# EAGLE design board_revA (EAGLE 7.4.0)
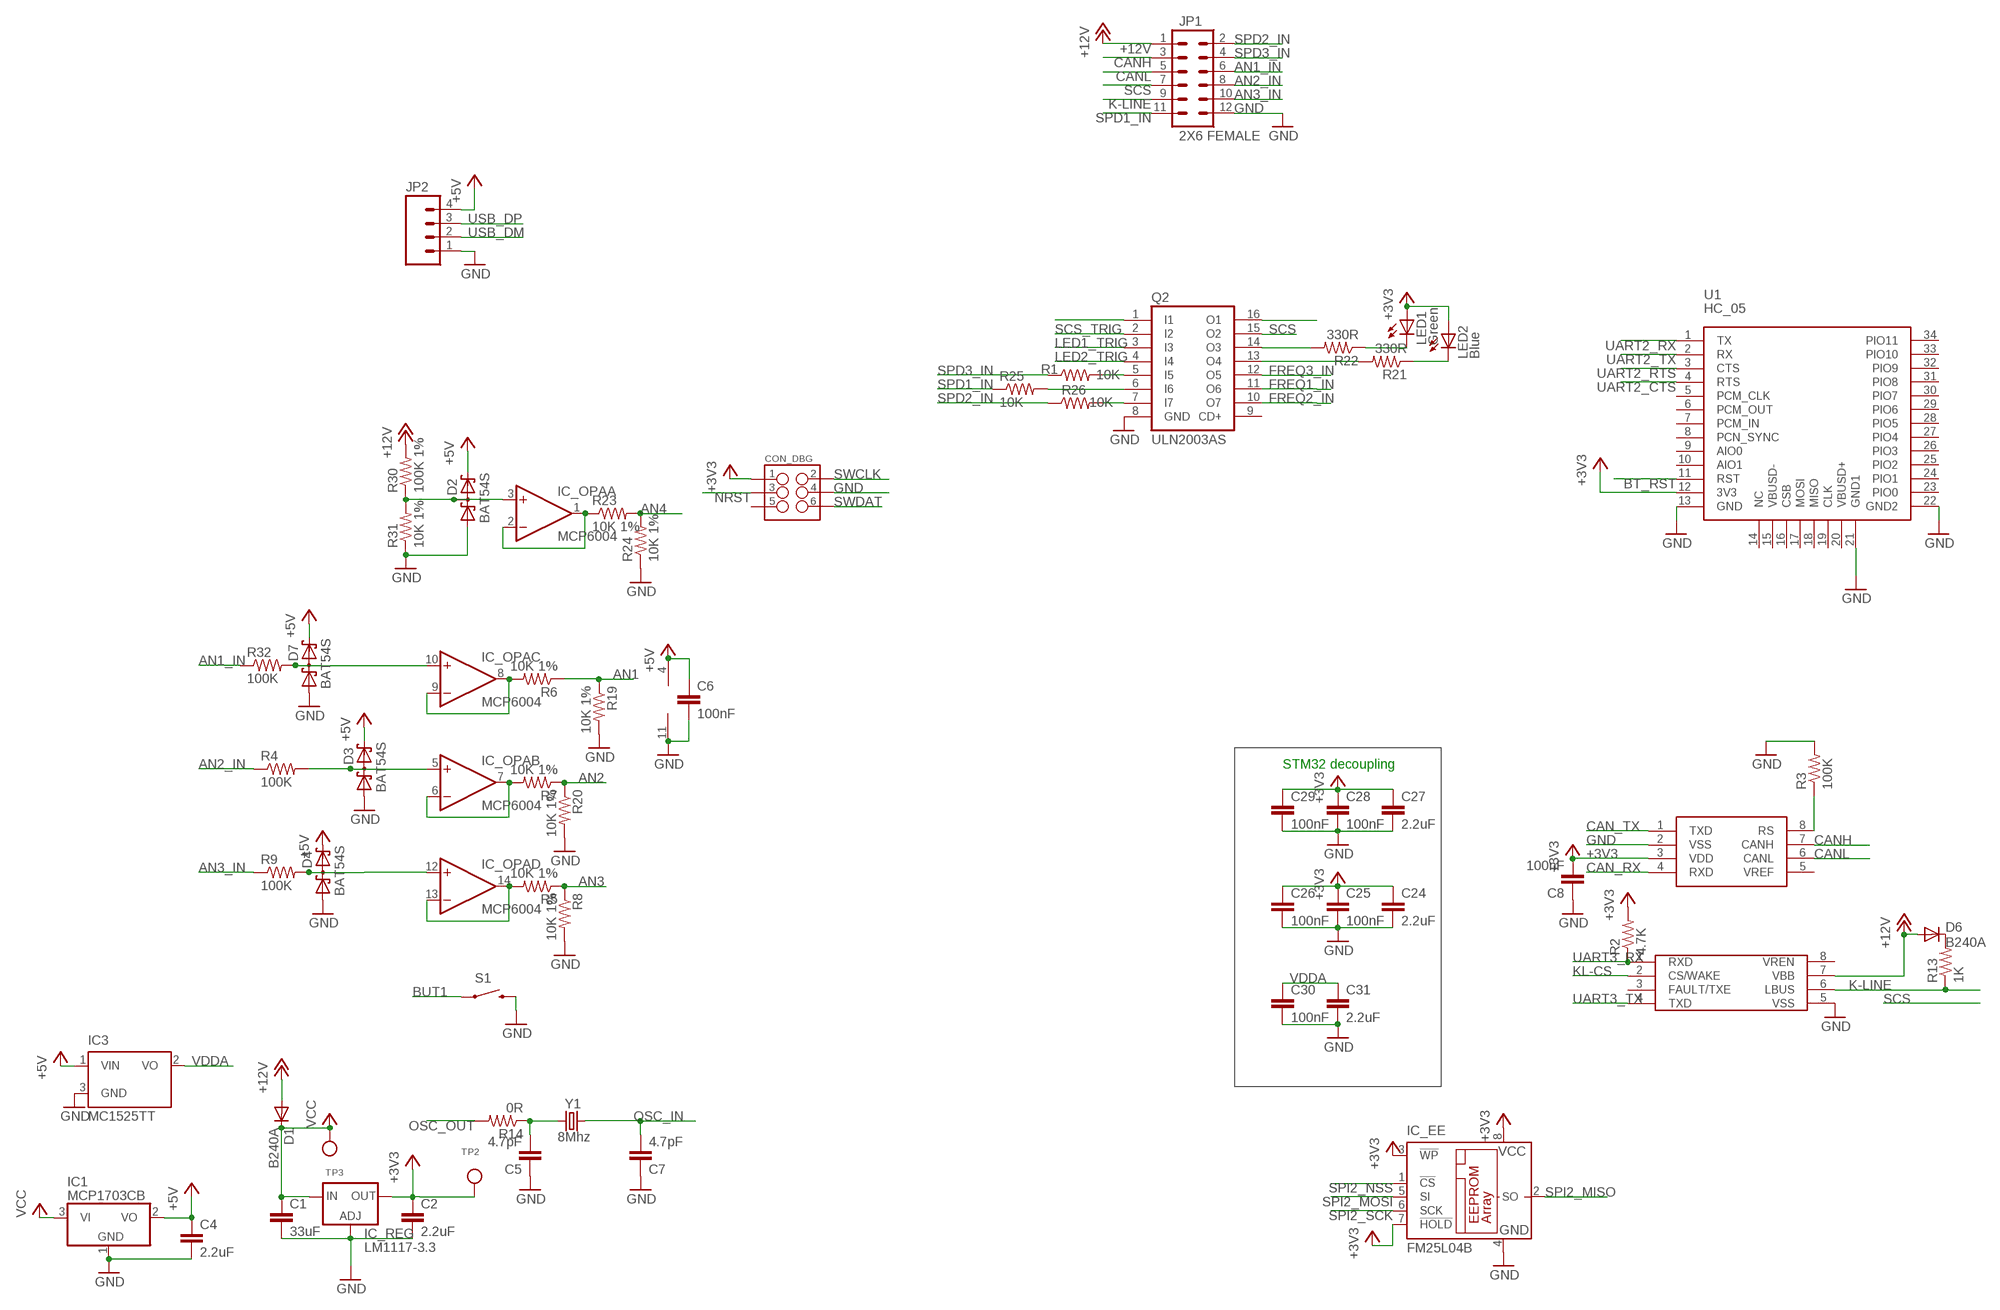
[diagram p0: schematic, sheet 1, part 1 of 2]
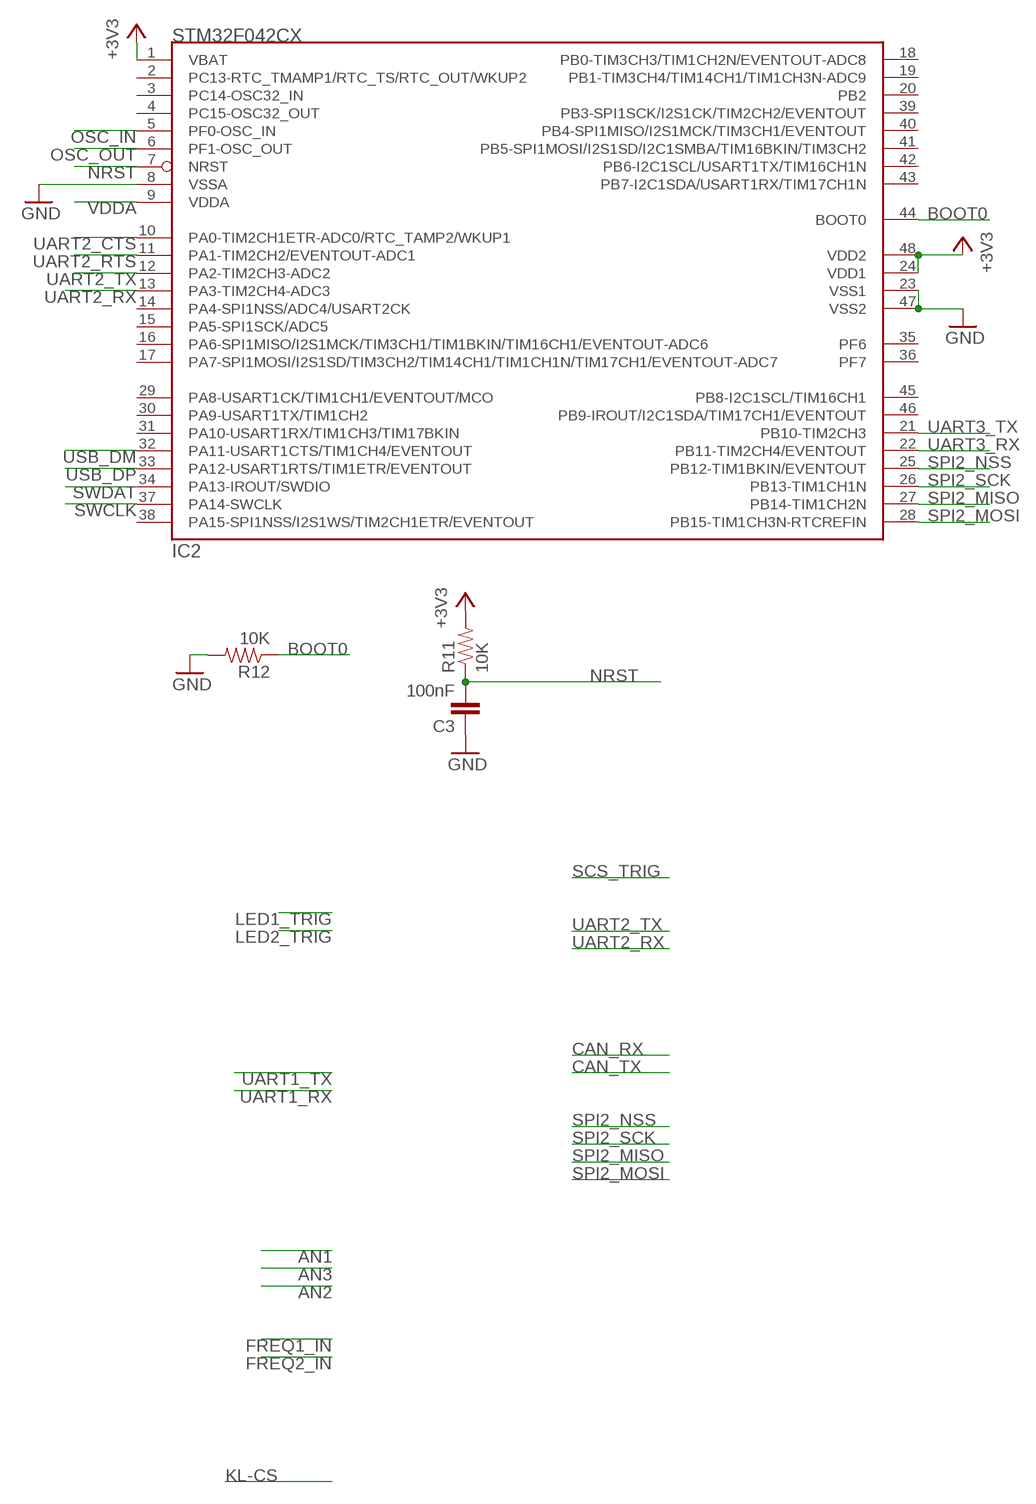
[diagram p1: schematic, sheet 1, part 2 of 2]

## Parts
C1  33uF  CAPPTH  [CAP-PTH-SMALL]
C2  2.2uF  CAP0603-CAP  [0603-CAP]
C3  100nF  CAP0603-CAP  [0603-CAP]
C4  2.2uF  CAP0603-CAP  [0603-CAP]
C5  4.7pF  CAP0603-CAP  [0603-CAP]
C6  100nF  CAP0603-CAP  [0603-CAP]
C7  4.7pF  CAP0603-CAP  [0603-CAP]
C8  100nF  CAP0603-CAP  [0603-CAP]
C24  2.2uF  CAP0603-CAP  [0603-CAP]
C25  100nF  CAP0603-CAP  [0603-CAP]
C26  100nF  CAP0603-CAP  [0603-CAP]
C27  2.2uF  CAP0603-CAP  [0603-CAP]
C28  100nF  CAP0603-CAP  [0603-CAP]
C29  100nF  CAP0603-CAP  [0603-CAP]
C30  100nF  CAP0603-CAP  [0603-CAP]
C31  2.2uF  CAP0603-CAP  [0603-CAP]
CON_DBG  M03X22X3_SILK_SM  [2X3]
D1  B240A  DIODESOD  [SOD-323]
D2  BAT54S  [SOT23]
D3  BAT54S  [SOT23]
D4  BAT54S  [SOT23]
D6  B240A  DIODESOD  [SOD-323]
D7  BAT54S  [SOT23]
IC1  MCP1703CB  [SOT23]
IC2  STM32F042CX  STM32F050CX  [LQFP48]
IC3  MC1525TT  [SOT23]
IC_CAN  MAX3051  MCP2551  [SO08]
IC_EE  FM25L04B  25LC080SN  [SO-08]
IC_KLINE  MCP2004  [SO08]
IC_OPA  MCP6004  LMV324MZ  [TSSOP14]
IC_REG  LM1117-3.3  LD117AS33TR  [SOT223]
JP1  2X6 FEMALE  M06X2PTH_FEMALE  [2X6]
JP2  M04LOCK  [1X04_LOCK]
LED1  Green  LED3MM  [LED3MM]
LED2  Blue  LED3MM  [LED3MM]
Q2  ULN2003AS  [SSOP16]
R1  10K  RESISTOR0603-RES  [0603-RES]
R2  4.7K  RESISTOR0603-RES  [0603-RES]
R3  100K  RESISTOR0603-RES  [0603-RES]
R4  100K  RESISTOR0603-RES  [0603-RES]
R5  10K 1%  RESISTOR0603-RES  [0603-RES]
R6  10K 1%  RESISTOR0603-RES  [0603-RES]
R7  10K 1%  RESISTOR0603-RES  [0603-RES]
R8  10K 1%  RESISTOR0603-RES  [0603-RES]
R9  100K  RESISTOR0603-RES  [0603-RES]
R11  10K  RESISTOR0603-RES  [0603-RES]
R12  10K  RESISTOR0603-RES  [0603-RES]
R13  1K  RESISTOR0603-RES  [0603-RES]
R14  0R  RESISTOR0603-RES  [0603-RES]
R19  10K 1%  RESISTOR0603-RES  [0603-RES]
R20  10K 1%  RESISTOR0603-RES  [0603-RES]
R21  330R  RESISTOR0603-RES  [0603-RES]
R22  330R  RESISTOR0603-RES  [0603-RES]
R23  10K 1%  RESISTOR0603-RES  [0603-RES]
R24  10K 1%  RESISTOR0603-RES  [0603-RES]
R25  10K  RESISTOR0603-RES  [0603-RES]
R26  10K  RESISTOR0603-RES  [0603-RES]
R30  100K 1%  RESISTOR0603-RES  [0603-RES]
R31  10K 1%  RESISTOR0603-RES  [0603-RES]
R32  100K  RESISTOR0603-RES  [0603-RES]
S1  SWITCH-MOMENTARY-2PTH  [TACTILE-PTH]
TP2  TESTPOINTROUND1MM  [TESTPOINT_ROUND_1MM]
TP3  TESTPOINTROUND1MM  [TESTPOINT_ROUND_1MM]
U1  HC_05  [BLUETOOTH_SMD]
Y1  8Mhz  CRYSTALHC49US  [HC49US]

## Nets
+3V3: C2.1 C8.2 C24.1 C25.1 C26.1 C27.1 C28.1 C29.1 CON_DBG.1 IC2.1(VBAT) IC_CAN.3(VDD) IC_EE.3(!WP) IC_EE.7(!HOLD) IC_EE.8(VCC) IC_REG.4(OUT) LED1.A LED2.A R2.2 R11.2 TP2.P$1 U1.12(3V3)
+5V: C4.1 C6.1 D2.2(C2) D3.2(C2) D4.2(C2) D7.2(C2) IC1.2(VO) IC3.1(VIN) IC_OPA.4(P:V+) JP2.4
+12V: D1.2(A) D6.2(A) IC_KLINE.7(VBB) JP1.1 R30.2
AN1: R6.1 R19.1
AN1_IN: JP1.6 R32.1
AN1_N: IC_OPA.1(A:OUT) IC_OPA.2(A:-IN) R23.1
AN2: R7.1 R20.1
AN2_IN: JP1.8 R4.1
AN2_N: IC_OPA.8(C:OUT) IC_OPA.9(C:-IN) R6.2
AN3: R5.1 R8.1
AN3_IN: JP1.10 R9.1
AN3_N: IC_OPA.6(B:-IN) IC_OPA.7(B:OUT) R7.2
AN4: R23.2 R24.2
BOOT0: IC2.44(BOOT0) R12.1
BT_RST: U1.11(RST)
BUT1: S1.1
CAN_RX: IC_CAN.4(RXD)
CAN_TX: IC_CAN.1(TXD)
CANH: IC_CAN.7(CANH) JP1.3
CANL: IC_CAN.6(CANL) JP1.5
FREQ1_IN: Q2.11(O6)
FREQ2_IN: Q2.10(O7)
FREQ3_IN: Q2.12(O5)
GND: C1.2 C2.2 C3.1 C4.2 C5.1 C6.2 C7.1 C8.1 C24.2 C25.2 C26.2 C27.2 C28.2 C29.2 C30.2 C31.2 CON_DBG.4 D2.1(A1) D3.1(A1) D4.1(A1) D7.1(A1) IC1.1(GND) IC2.8(VSSA) IC2.23(VSS1) IC2.47(VSS2) IC3.3(GND) IC_CAN.2(VSS) IC_EE.4(GND) IC_KLINE.5(VSS) IC_OPA.11(P:V-) IC_REG.1(ADJ) JP1.12 JP2.1 Q2.8(GND) R3.2 R8.2 R12.2 R19.2 R20.2 R24.1 R31.1 S1.3 U1.13(GND) U1.21(GND1) U1.22(GND2)
K-LINE: IC_KLINE.6(LBUS) JP1.9 R13.1
KL-CS: IC_KLINE.2(CS/WAKE)
LED1_TRIG: Q2.3(I3)
LED2_TRIG: Q2.4(I4)
N$1: Q2.5(I5) R1.2
N$2: IC_OPA.13(D:-IN) IC_OPA.14(D:OUT) R5.2
N$3: D4.3(C1A2) IC_OPA.12(D:+IN) R9.2
N$4: Q2.1(I1)
N$5: D3.3(C1A2) IC_OPA.5(B:+IN) R4.2
N$6: Q2.16(O1)
N$8: IC_CAN.8(RS) R3.1
N$9: Q2.7(I7) R26.2
N$10: LED2.K(C) R21.1
N$11: Q2.13(O4) R21.2
N$13: D6.1(C) R13.2
N$14: C5.2 R14.1 Y1.1
N$15: Q2.14(O3) R22.2
N$16: Q2.6(I6) R25.2
N$19: LED1.K(C) R22.1
N$24: D2.3(C1A2) IC_OPA.3(A:+IN) R30.1 R31.2
N$25: D7.3(C1A2) IC_OPA.10(C:+IN) R32.2
NRST: C3.2 CON_DBG.3 IC2.7(NRST) R11.1
OSC_IN: C7.2 IC2.5(PF0-OSC_IN) Y1.2
OSC_OUT: IC2.6(PF1-OSC_OUT) R14.2
SCS: JP1.7 Q2.15(O2)
SCS_TRIG: Q2.2(I2)
SPD1_IN: JP1.11 R25.1
SPD2_IN: JP1.2 R26.1
SPD3_IN: JP1.4 R1.1
SPI2_MISO: IC2.27(PB14-TIM1CH2N) IC_EE.2(SO)
SPI2_MOSI: IC2.28(PB15-TIM1CH3N-RTCREFIN) IC_EE.5(SI)
SPI2_NSS: IC2.25(PB12-TIM1BKIN/EVENTOUT) IC_EE.1(!CS)
SPI2_SCK: IC2.26(PB13-TIM1CH1N) IC_EE.6(SCK)
SWCLK: CON_DBG.2 IC2.37(PA14-SWCLK)
SWDAT: CON_DBG.6 IC2.34(PA13-IROUT/SWDIO)
UART2_CTS: IC2.10(PA0-TIM2CH1ETR-ADC0/RTC_TAMP2/WKUP1) U1.4(RTS)
UART2_RTS: IC2.11(PA1-TIM2CH2/EVENTOUT-ADC1) U1.3(CTS)
UART2_RX: IC2.13(PA3-TIM2CH4-ADC3) U1.1(TX)
UART2_TX: IC2.12(PA2-TIM2CH3-ADC2) U1.2(RX)
UART3_RX: IC2.22(PB11-TIM2CH4/EVENTOUT) IC_KLINE.1(RXD) R2.1
UART3_TX: IC2.21(PB10-TIM2CH3) IC_KLINE.4(TXD)
USB_DM: IC2.32(PA11-USART1CTS/TIM1CH4/EVENTOUT) JP2.2
USB_DP: IC2.33(PA12-USART1RTS/TIM1ETR/EVENTOUT) JP2.3
VCC: C1.1 D1.1(C) IC1.3(VI) IC_REG.3(IN) TP3.P$1
VDD1: IC2.24(VDD1) IC2.48(VDD2) ; supply symbol labelled +3V3
VDDA: C30.1 C31.1 IC2.9(VDDA) IC3.2(VO)
Unconnected: CON_DBG.5 IC2.2(PC13-RTC_TMAMP1/RTC_TS/RTC_OUT/WKUP2) IC2.3(PC14-OSC32_IN) IC2.4(PC15-OSC32_OUT) IC2.14(PA4-SPI1NSS/ADC4/USART2CK) IC2.15(PA5-SPI1SCK/ADC5) IC2.16(PA6-SPI1MISO/I2S1MCK/TIM3CH1/TIM1BKIN/TIM16CH1/EVENTOUT-ADC6) IC2.17(PA7-SPI1MOSI/I2S1SD/TIM3CH2/TIM14CH1/TIM1CH1N/TIM17CH1/EVENTOUT-ADC7) IC2.18(PB0-TIM3CH3/TIM1CH2N/EVENTOUT-ADC8) IC2.19(PB1-TIM3CH4/TIM14CH1/TIM1CH3N-ADC9) IC2.20(PB2) IC2.29(PA8-USART1CK/TIM1CH1/EVENTOUT/MCO) IC2.30(PA9-USART1TX/TIM1CH2) IC2.31(PA10-USART1RX/TIM1CH3/TIM17BKIN) IC2.35(PF6) IC2.36(PF7) IC2.38(PA15-SPI1NSS/I2S1WS/TIM2CH1ETR/EVENTOUT) IC2.39(PB3-SPI1SCK/I2S1CK/TIM2CH2/EVENTOUT) IC2.40(PB4-SPI1MISO/I2S1MCK/TIM3CH1/EVENTOUT) IC2.41(PB5-SPI1MOSI/I2S1SD/I2C1SMBA/TIM16BKIN/TIM3CH2) IC2.42(PB6-I2C1SCL/USART1TX/TIM16CH1N) IC2.43(PB7-I2C1SDA/USART1RX/TIM17CH1N) IC2.45(PB8-I2C1SCL/TIM16CH1) IC2.46(PB9-IROUT/I2C1SDA/TIM17CH1/EVENTOUT) IC_CAN.5(VREF) IC_KLINE.3(FAULT/TXE) IC_KLINE.8(VREN) Q2.9(CD+) U1.5(PCM_CLK) U1.6(PCM_OUT) U1.7(PCM_IN) U1.8(PCN_SYNC) U1.9(AIO0) U1.10(AIO1) U1.14(NC) U1.15(VBUSD-) U1.16(CSB) U1.17(MOSI) U1.18(MISO) U1.19(CLK) U1.20(VBUSD+) U1.23(PIO0) U1.24(PIO1) U1.25(PIO2) U1.26(PIO3) U1.27(PIO4) U1.28(PIO5) U1.29(PIO6) U1.30(PIO7) U1.31(PIO8) U1.32(PIO9) U1.33(PIO10) U1.34(PIO11)

## Notes on the sheet
- STM32 decoupling

## Library data of the parts
C1 C2 C4 C24 C27 = SparkFun-Passives:CAP: Capacitor Standard 0603 ceramic capacitor, and 0.1" leaded capacitor.
C3 C5-C8 C25 C26 C28-C31 = SparkFun-Capacitors:CAP: Capacitor Standard 0603 ceramic capacitor, and 0.1" leaded capacitor.
CON_DBG = SparkFun-Connectors:M03X2: 2x3 .1" header. Shrouded, with keying- CONN-10681 SMT- CONN-11415 Pogo pins- HW-11044
D1 D6 = SparkFun-DiscreteSemi:DIODE: Diode These are standard reverse protection diodes and small signal diodes. SMA package can handle up to about 1A. SOD-323 can handle about 200mA. What the SOD-323 package when ordering, there are some mfgs out there that are 5-pin packages.
D2-D4 D7 = diode:BAT54S: Schottky Diodes Pin connection corrected 2011-05-04 Source: Fairchild .. BAT54.pdf
IC1 = linear:MCP1703: 250 mA, 16V, Low Quiescent Current LDO Regulator Source: http://ww1.microchip.com/downloads/en/DeviceDoc/22049b.pdf
IC2 = pel_stm32:STM32F050CX
IC3 = microchip:MC15*: 2.5V and 4.096V Voltage References Source: http://www.microchip.com .. 21653b.pdf; OC_FARNELL: unknown; OC_NEWARK: unknown
IC_CAN = SparkFun-DigitalIC:MCP2551: CAN transceiver
IC_EE = microchip:25*: Serial EEPROM 4K/ 8K , SPI bus; MF: MICROCHIP; MPN: 25LC080/SN; OC_FARNELL: 1137302; OC_NEWARK: 96K4092
IC_KLINE = misc:MCP2004
IC_OPA = linear:LMV324?*: Quad General Purpose, Low Voltage, Rail-to-Rail Output Operational Amplifiers Source: http://www.national.com/mpf/LM/LMV321.html http://www.national.com/dt/lmv_qual.pdf
IC_REG = v-reg:LD117A?*: Low drop fixed and adjustable positive voltage regulators 1 A Source: http://www.st.com/stonline/products/literature/ds/7194/ld1117axx.pdf
JP1 = SparkFun-Connectors:M06X2; PROD_ID: CONN-12423
JP2 = SparkFun-Connectors:M04: Header 4 Standard 4-pin 0.1" header. Use with straight break away headers (SKU : PRT-00116), right angle break away headers (PRT-00553), swiss pins (PRT-00743), machine pins (PRT-00117), and female headers (PRT-00115). Molex polarized connector foot print use with SKU : PRT-08231 with associated crimp pins and housings. 1MM SMD Version SKU: PRT-10208
LED1 LED2 = SparkFun-LED:LED: LEDs Standard schematic elements and footprints for 5mm, 3mm, 1206, and 0603 sized LEDs. 5mm - Spark Fun Electronics SKU : COM-00529 (and others)
Q2 = misc:ULN2003A: DRIVER ARRAY
R1-R9 R11-R14 R19-R26 R30-R32 = SparkFun-Resistors:RESISTOR: Resistor Basic schematic elements and footprints for 0603, 1206, and PTH resistors.
S1 = SparkFun-Electromechanical:SWITCH-MOMENTARY-2: Various NO switches- pushbuttons, reed, etc; PROD_ID: SWCH-08441
TP2 TP3 = microbuilder:TESTPOINT: Test Point Various test points for characterisation and PCB testing TESTPOINT_SMT - Compact Surface Mount Test Point [Digikey: 5016KTR-ND]
U1 = Bluetooth HC-05:HC_05: HC-05 Bluetooth Module
Y1 = SparkFun-FreqCtrl:CRYSTAL: Various standard crystals. Proven footprints. Spark Fun Electronics SKU : COM-00534

## Net classes
1 HV: width 0.813 mm, clearance 0.61 mm

## Board
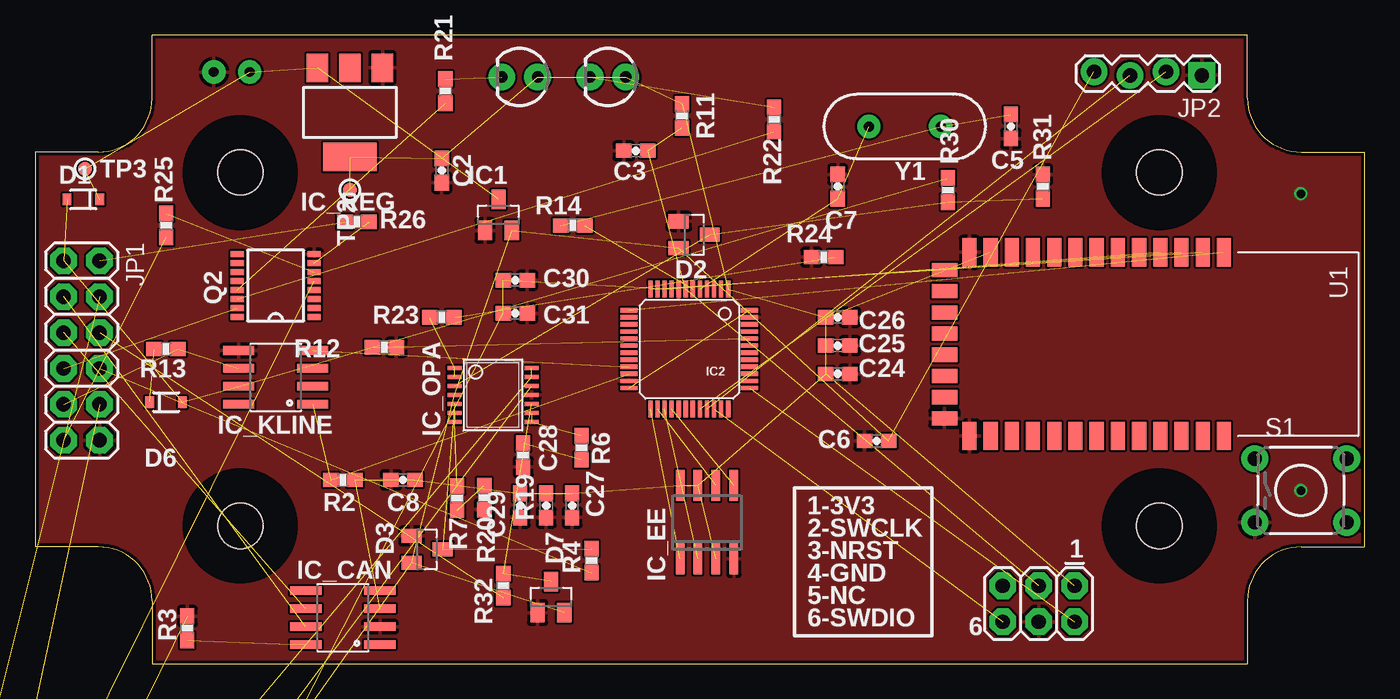
[diagram p2: board, top side]
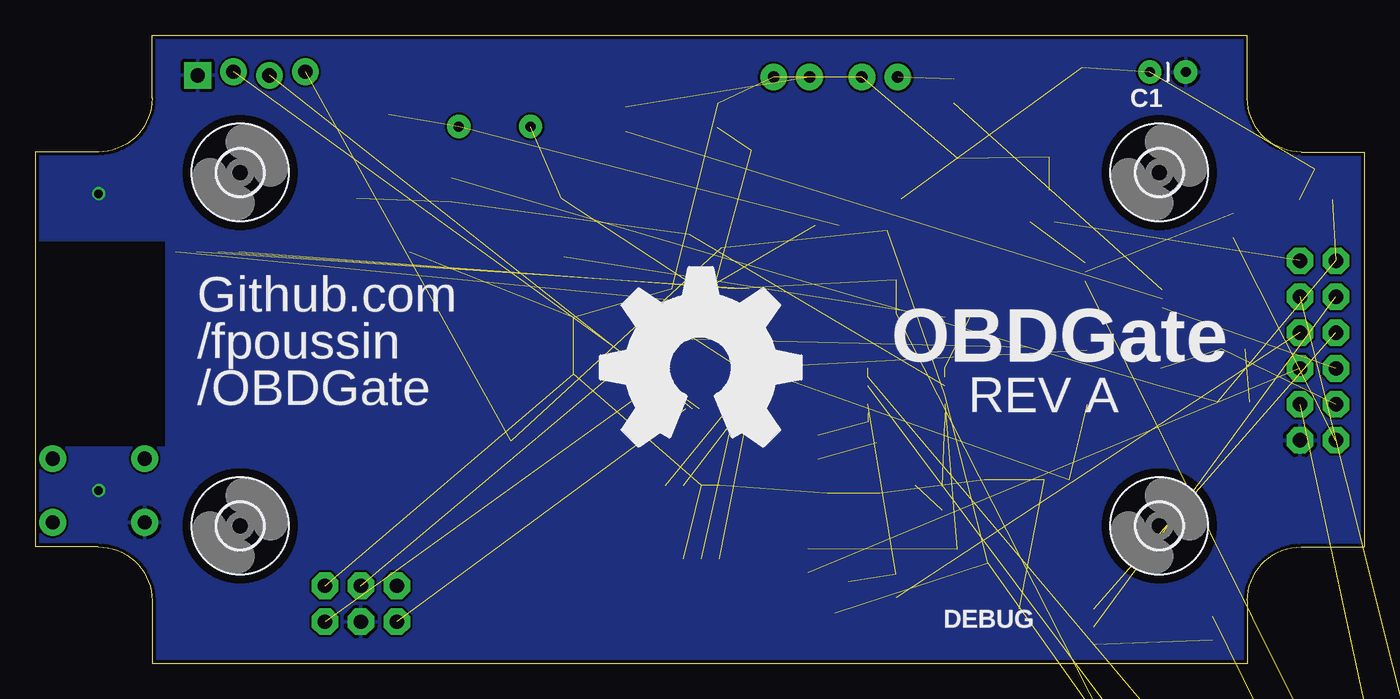
[diagram p3: board, bottom side, seen from below]

Size 93.98 x 44.45 mm. Coordinates in mm from the lower left corner, seen from the top.
Outline: 8.26,0 85.72,0 85.72,4.45 arc-90 89.53,8.26 93.98,8.26 93.98,36.2 89.53,36.2 arc-90 85.72,40.01 85.72,44.45 8.26,44.45 8.26,40.01 arc-90 4.45,36.2 0,36.2 0,8.26 4.45,8.26 arc-90 8.26,4.45 8.26,0
Copper layers (1*16): Top 0.035mm / dielectric 1.5mm / Bottom 0.035mm
Design rules "SeeedStudio_2layer_DRU_no_angle_20140221 *": minimum track width 8mil, minimum drill 12mil, track to track 6mil, track to pad 6mil, pad to pad 6mil, via to via 6mil, smd to smd 0mil, copper to edge 10mil, drill to drill 10mil, minimum pad ring 10mil, minimum via ring 6mil, stop-mask expansion 2mil, vias tented up to drill 100mil, thermal gap 10mil

### Footprints (pad centres in the part's own frame; a part is rotated, then mirrored left to right if it is on the bottom)
CAP-PTH-SMALL = drill 0.7 pad 1.651: 1 0,0; 2 2.54,0
0603-CAP = smd 1.1 x 1: 1 -0.85,0; 2 0.85,0
2X3 = drill 1.016 pad 1.88 octagon: 1 0,0; 2 0,2.54; 3 2.54,0; 4 2.54,2.54; 5 5.08,0; 6 5.08,2.54
SOD-323 = smd 0.63 x 0.83: 1 -1.15,0; 2 1.15,0
SOT23 = smd 1 x 1.4: 1 -0.95,-1.1; 2 0.95,-1.1; 3 0,1.1
LQFP48 = smd 0.3 x 1.2: 1 -2.75,-4.25; 2 -2.25,-4.25; 3 -1.75,-4.25; 4 -1.25,-4.25; 5 -0.75,-4.25; 6 -0.25,-4.25; 7 0.25,-4.25; 8 0.75,-4.25; 9 1.25,-4.25; 10 1.75,-4.25; 11 2.25,-4.25; 12 2.75,-4.25; 25 2.75,4.25; 26 2.25,4.25; 27 1.75,4.25; 28 1.25,4.25; 29 0.75,4.25; 30 0.25,4.25; 31 -0.25,4.25; 32 -0.75,4.25; 33 -1.25,4.25; 34 -1.75,4.25; 35 -2.25,4.25; 36 -2.75,4.25 | smd 1.2 x 0.3: 13 4.25,-2.75; 14 4.25,-2.25; 15 4.25,-1.75; 16 4.25,-1.25; 17 4.25,-0.75; 18 4.25,-0.25; 19 4.25,0.25; 20 4.25,0.75; 21 4.25,1.25; 22 4.25,1.75; 23 4.25,2.25; 24 4.25,2.75; 37 -4.25,2.75; 38 -4.25,2.25; 39 -4.25,1.75; 40 -4.25,1.25; 41 -4.25,0.75; 42 -4.25,0.25; 43 -4.25,-0.25; 44 -4.25,-0.75; 45 -4.25,-1.25; 46 -4.25,-1.75; 47 -4.25,-2.25; 48 -4.25,-2.75
SO08 = smd 0.61 x 2.21: 1 -1.905,-2.616; 2 -0.635,-2.616; 3 0.635,-2.616; 4 1.905,-2.616; 5 1.905,2.616; 6 0.635,2.616; 7 -0.635,2.616; 8 -1.905,2.616
SO-08 = smd 0.6 x 2.2: 1 -1.905,-2.6; 2 -0.635,-2.6; 3 0.635,-2.6; 4 1.905,-2.6; 5 1.905,2.6; 6 0.635,2.6; 7 -0.635,2.6; 8 -1.905,2.6
TSSOP14 = smd 0.305 x 0.991: 1 -1.905,-2.718; 2 -1.27,-2.718; 3 -0.635,-2.718; 4 0,-2.718; 5 0.635,-2.718; 6 1.27,-2.718; 7 1.905,-2.718; 8 1.905,2.718; 9 1.27,2.718; 10 0.635,2.718; 11 0,2.718; 12 -0.635,2.718; 13 -1.27,2.718; 14 -1.905,2.718
SOT223 = smd 1.5 x 2: 1 -2.3,-3.15; 2 0,-3.15; 3 2.3,-3.15 | smd 3.8 x 2: 4 0,3.15
2X6 = drill 1.016 pad 1.88 octagon: 1 0,0; 2 0,2.54; 3 2.54,0; 4 2.54,2.54; 5 5.08,0; 6 5.08,2.54; 7 7.62,0; 8 7.62,2.54; 9 10.16,0; 10 10.16,2.54; 11 12.7,0; 12 12.7,2.54
1X04_LOCK = drill 1.016 pad 1.88 square: 1 0,0.127 | drill 1.016 pad 1.88: 2 2.54,-0.127; 3 5.08,0.127; 4 7.62,-0.127
LED3MM = drill 0.813 pad 1.88: A -1.27,0; K 1.27,0
SSOP16 = smd 0.914 x 0.406: 1 -2.718,2.223; 2 -2.718,1.587; 3 -2.718,0.953; 4 -2.718,0.318; 5 -2.718,-0.318; 6 -2.718,-0.953; 7 -2.718,-1.587; 8 -2.718,-2.223; 9 2.718,-2.223; 10 2.718,-1.587; 11 2.718,-0.953; 12 2.718,-0.318; 13 2.718,0.318; 14 2.718,0.953; 15 2.718,1.587; 16 2.718,2.223
0603-RES = smd 1.1 x 1: 1 -0.85,0; 2 0.85,0
TACTILE-PTH = drill 1.016 pad 1.88: 1 -3.251,2.261; 2 3.251,2.261; 3 -3.251,-2.261; 4 3.251,-2.261
TESTPOINT_ROUND_1MM = smd 1 x 1: P$1 0,0
BLUETOOTH_SMD = smd 2 x 1: 1 -6.35,3.81; 2 -6.35,2.31; 3 -6.35,0.81; 4 -6.35,-0.69; 5 -6.35,-2.19; 6 -6.35,-3.69; 7 -6.35,-5.19; 8 -6.35,-6.69; 9 -6.35,-8.19; 10 -6.35,-9.69; 11 -6.35,-11.19; 12 -6.35,-12.69; 13 -6.35,-14.19; 22 6.65,-14.19; 23 6.65,-12.69; 24 6.65,-11.19; 25 6.65,-9.69; 26 6.65,-8.19; 27 6.65,-6.69; 28 6.65,-5.19; 29 6.65,-3.69; 30 6.65,-2.19; 31 6.65,-0.69; 32 6.65,0.81; 33 6.65,2.31; 34 6.65,3.81 | smd 1 x 1.8: 14 -5.1,-15.94; 15 -3.6,-15.94; 16 -2.1,-15.94; 17 -0.6,-15.94; 18 0.9,-15.94; 19 2.4,-15.94; 20 3.9,-15.94; 21 5.4,-15.94
3,2 = hole 3.2: 0,0
HC49US = drill 0.7 pad 1.651: 1 -2.54,0; 2 2.54,0

### Placement (x,y rotation side)
C1  15.16,41.86 0 bottom
C2  28.75,34.88 270 top
C3  42.47,36.28 0 top
C4  -7.75,-45.75 0 top  (outside the outline)
C5  69,38 90 top
C6  59.5,15.75 180 top
C7  56.75,33.75 270 top
C8  26,13 0 top
C24  56.75,20.5 0 top
C25  56.75,22.5 0 top
C26  56.75,24.5 0 top
C27  37.97,11.19 270 top
C28  36.13,11.19 270 top
C29  34.29,11.19 270 top
C30  33.94,27.12 0 top
C31  33.94,24.79 0 top
CON_DBG  73.5,5.5 180 top
D1  3.39,32.84 180 top
D2  46.6,30.34 270 top
D3  27.71,8.08 270 top
D4  -7,-37.75 0 top  (outside the outline)
D6  9.25,18.5 0 top
D7  36.47,4.71 0 top
IC1  32.75,31.75 0 top
IC2  46.25,22.25 180 top
IC3  -7,-51 0 top  (outside the outline)
IC_CAN  21.75,3.25 90 top
IC_EE  47.5,10 0 top
IC_KLINE  17,20.25 90 top
IC_OPA  32.37,19.01 270 top
IC_REG  22.25,39 180 top
JP1  2,28.5 270 top
JP2  82.5,41.75 180 top
LED1  40.5,41.5 180 top
LED2  34.25,41.5 180 top
Q2  17,26.75 180 top
R1  -7.75,-26.5 0 top  (outside the outline)
R2  21.75,13 0 top
R3  10.75,2.5 90 top
R4  39.34,7.28 90 top
R5  -7.75,-29.5 0 top  (outside the outline)
R6  38.62,15.28 90 top
R7  29.83,11.7 90 top
R8  -7.75,-32.5 0 top  (outside the outline)
R9  -7.75,-42.75 0 top  (outside the outline)
R11  45.73,38.76 90 top
R12  24.68,22.38 0 top
R13  9.25,22.25 180 top
R14  38,31 0 top
R19  34.5,14.75 270 top
R20  31.75,11.75 270 top
R21  29,40.5 270 top
R22  52.25,38.5 270 top
R23  28.75,24.5 0 top
R24  55.75,28.75 0 top
R25  9.25,31 90 top
R26  22.75,31.25 0 top
R30  64.55,33.5 90 top
R31  71.25,33.75 270 top
R32  33.1,5.51 90 top
S1  89.5,12.25 0 top
TP2  22.25,33.5 90 top
TP3  3.5,35 0 top
U1  80.25,22.75 270 top
U$2  [3,2]  14.5,34.75 0 bottom
U$3  [3,2]  14.5,9.75 0 bottom
U$4  [3,2]  79.5,34.75 0 bottom
U$5  [3,2]  79.5,9.75 0 bottom
U$6  [OSHW_FILLX500_NOTEXT]  53.99,15.35 0 bottom
Y1  61.5,38 180 top

### Tracks (layer width: path | path; a pad name or v marks a point on that pad's centre or on a via)
+3V3  (20 unrouted)
+5V  (9 unrouted)
+12V  (4 unrouted)
AN1  (1 unrouted)
AN1_IN  (1 unrouted)
AN1_N  (2 unrouted)
AN2  (1 unrouted)
AN2_IN  (1 unrouted)
AN2_N  (2 unrouted)
AN3  (1 unrouted)
AN3_IN  (1 unrouted)
AN3_N  (2 unrouted)
AN4  (1 unrouted)
BOOT0  (1 unrouted)
CANH  (1 unrouted)
CANL  (1 unrouted)
GND  (via drill 0.6)  (4 unrouted)
  other vias: 89.5,33.25 89.5,12.25
  pour Bottom: 0,44.45 84.73,44.45 84.73,0 0,0
  pour Top: 0,44.45 93.98,44.45 93.98,0 0,0
  pour Bottom: 84.75,0 84.75,15.25 94,15.25 94,0
  pour Bottom: 84.75,44.5 94,44.5 94,30 84.75,30
K-LINE  (2 unrouted)
N$1  (1 unrouted)
N$2  (2 unrouted)
N$3  (2 unrouted)
N$5  (2 unrouted)
N$8  (1 unrouted)
N$9  (1 unrouted)
N$10  (1 unrouted)
N$11  (1 unrouted)
N$13  (1 unrouted)
N$14  (2 unrouted)
N$15  (1 unrouted)
N$16  (1 unrouted)
N$19  (1 unrouted)
N$24  (3 unrouted)
N$25  (2 unrouted)
NRST  (3 unrouted)
OSC_IN  (2 unrouted)
OSC_OUT  (1 unrouted)
SCS  (1 unrouted)
SPD1_IN  (1 unrouted)
SPD2_IN  (1 unrouted)
SPD3_IN  (1 unrouted)
SPI2_MISO  (1 unrouted)
SPI2_MOSI  (1 unrouted)
SPI2_NSS  (1 unrouted)
SPI2_SCK  (1 unrouted)
SWCLK  (1 unrouted)
SWDAT  (1 unrouted)
UART2_CTS  (1 unrouted)
UART2_RTS  (1 unrouted)
UART2_RX  (1 unrouted)
UART2_TX  (1 unrouted)
UART3_RX  (2 unrouted)
UART3_TX  (1 unrouted)
USB_DM  (1 unrouted)
USB_DP  (1 unrouted)
VCC  (4 unrouted)
VDD1  (1 unrouted)
VDDA  (3 unrouted)

### Text on the board
tPlace: 1-3V3 | 2-SWCLK | 1 | 3-NRST | 4-GND | 5-NC | 6-SWDIO | 6
bPlace: OBDGate | REV A | Github.com / /fpoussin / /OBDGate
bNames: DEBUG